# Altium schematic sheet AD9363_Power_Misc.SchDoc
size A4
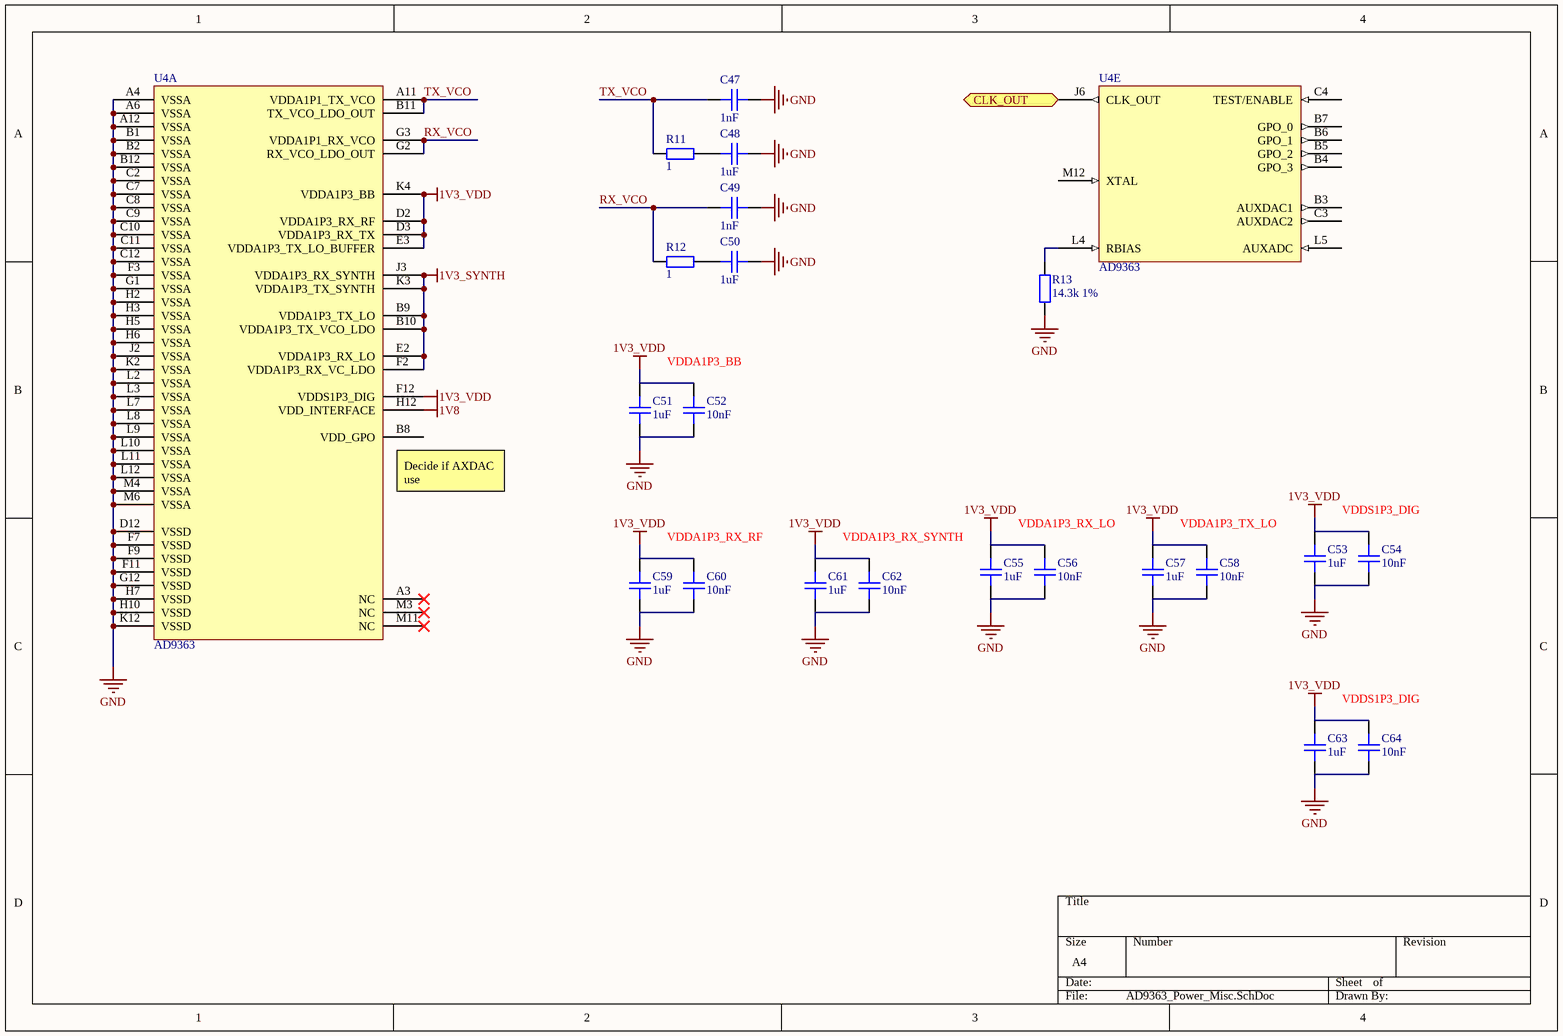
[diagram p0: AD9363_Power_Misc.SchDoc]

## Parts
C47  1nF  [CAP0402]
C48  1uF  [CAP0402]
C49  1nF  [CAP0402]
C50  1uF  [CAP0402]
C51  1uF  [CAP0402]
C52  10nF  [CAP0402]
C53  1uF  [CAP0402]
C54  10nF  [CAP0402]
C55  1uF  [CAP0402]
C56  10nF  [CAP0402]
C57  1uF  [CAP0402]
C58  10nF  [CAP0402]
C59  1uF  [CAP0402]
C60  10nF  [CAP0402]
C61  1uF  [CAP0402]
C62  10nF  [CAP0402]
C63  1uF  [CAP0402]
C64  10nF  [CAP0402]
R11  1  [RES0402]
R12  1  [RES0402]
R13  14.3k 1%  [RES0402]
U4  AD9363  [BGA144C80P12X12_1000X1000X100]  (parts A,E of 5)

## Ports
CLK_OUT (out)

## Nets
1V3_SYNTH: U4.B9(VDDA1P3_TX_LO) U4.B10(VDDA1P3_TX_VCO_LDO) U4.E2(VDDA1P3_RX_LO) U4.F2(VDDA1P3_RX_VC_LDO) U4.J3(VDDA1P3_RX_SYNTH) U4.K3(VDDA1P3_TX_SYNTH)
1V3_VDD: U4.D2(VDDA1P3_RX_RF) U4.D3(VDDA1P3_RX_TX) U4.E3(VDDA1P3_TX_LO_BUFFER) U4.F12(VDDS1P3_DIG) U4.K4(VDDA1P3_BB)
1V8: U4.H12(VDD_INTERFACE)
GND: U4.A4(VSSA) U4.A6(VSSA) U4.A12(VSSA) U4.B1(VSSA) U4.B2(VSSA) U4.B12(VSSA) U4.C2(VSSA) U4.C7(VSSA) U4.C8(VSSA) U4.C9(VSSA) U4.C10(VSSA) U4.C11(VSSA) U4.C12(VSSA) U4.D12(VSSD) U4.F3(VSSA) U4.F7(VSSD) U4.F9(VSSD) U4.F11(VSSD) U4.G1(VSSA) U4.G12(VSSD) U4.H2(VSSA) U4.H3(VSSA) U4.H5(VSSA) U4.H6(VSSA) U4.H7(VSSD) U4.H10(VSSD) U4.J2(VSSA) U4.K2(VSSA) U4.K12(VSSD) U4.L2(VSSA) U4.L3(VSSA) U4.L7(VSSA) U4.L8(VSSA) U4.L9(VSSA) U4.L10(VSSA) U4.L11(VSSA) U4.L12(VSSA) U4.M4(VSSA) U4.M6(VSSA)
CLK_OUT: U4.J6(CLK_OUT) ; port CLK_OUT
RX_VCO: U4.G2(RX_VCO_LDO_OUT) U4.G3(VDDA1P1_RX_VCO)
TX_VCO: U4.A11(VDDA1P1_TX_VCO) U4.B11(TX_VCO_LDO_OUT)

Not connected (* = marked no-connect by the designer): C47 1 2; C48 1 2; C49 1 2; C50 1 2; C51 1 2; C52 1 2; C53 1 2; C54 1 2; C55 1 2; C56 1 2; C57 1 2; C58 1 2; C59 1 2; C60 1 2; C61 1 2; C62 1 2; C63 1 2; C64 1 2; R11 1 2; R12 1 2; R13 1 2; U4 A3(NC)* B3(AUXDAC1) B4(GPO_3) B5(GPO_2) B6(GPO_1) B7(GPO_0) B8(VDD_GPO) C3(AUXDAC2) C4(TEST/ENABLE) L4(RBIAS) L5(AUXADC) M3(NC)* M11(NC)* M12(XTAL)

## Notes on the sheet
- (near C52) VDDA1P3_BB
- (near U4) Decide if AXDAC use
- (near C54) VDDS1P3_DIG
- (near C60) VDDA1P3_RX_RF
- (near C62) VDDA1P3_RX_SYNTH
- (near C56) VDDA1P3_RX_LO
- (near C58) VDDA1P3_TX_LO
- (near C64) VDDS1P3_DIG
- Labels drawn without touching a wire or pin: GND

## Library data of the parts
C47-C64 = Cap_0402
  C47 C49: Value: 1nF
  C48 C50 C51 C53 C55 C57 C59 C61 C63: Value: 1uF
  C52 C54 C56 C58 C60 C62 C64: Value: 10nF
R11-R13 = Res_0402
  R11 R12: Value: 1
  R13: Value: 14.3k 1%